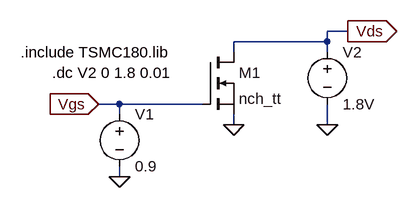
[diagram p0: schematic Problem_4c1.asc]
Problem_4c1.asc, the LTspice schematic file:
Version 4
SHEET 1 880 680
WIRE 448 64 416 64
WIRE 416 80 416 64
WIRE 416 80 272 80
WIRE 272 96 272 80
WIRE 416 96 416 80
WIRE 96 176 64 176
WIRE 224 176 96 176
WIRE 96 192 96 176
WIRE 272 208 272 192
WIRE 416 208 416 176
WIRE 96 288 96 272
FLAG 96 288 0
FLAG 272 208 0
FLAG 416 208 0
FLAG 64 176 Vgs
IOPIN 64 176 In
FLAG 448 64 Vds
IOPIN 448 64 Out
SYMBOL nmos 224 96 R0
SYMATTR InstName M1
SYMATTR Value nch_tt
SYMBOL voltage 96 176 R0
WINDOW 123 0 0 Left 0
WINDOW 39 0 0 Left 0
SYMATTR InstName V1
SYMATTR Value 0.9
SYMBOL voltage 416 80 R0
WINDOW 123 0 0 Left 0
WINDOW 39 0 0 Left 0
SYMATTR InstName V2
SYMATTR Value 1.8V
TEXT -56 96 Left 2 !.include TSMC180.lib
TEXT -8 128 Left 2 !.dc V2 0 1.8 0.01

The netlist it stands for:
* Problem_4c1.asc
M1 Vds Vgs 0 0 nch_tt
V1 Vgs 0 0.9
V2 Vds 0 1.8V
.model NMOS NMOS
.model PMOS PMOS
.lib standard.mos
.include TSMC180.lib
.dc V2 0 1.8 0.01
.backanno
.end

* Results of the author's LTspice run, read from the files saved beside the schematic
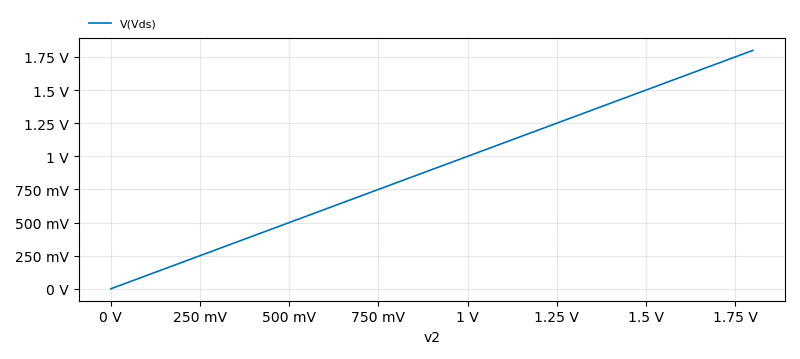
[diagram p1: DC transfer characteristic of Problem_4c1.asc, plotted from the saved traces]
* DC transfer characteristic, 1 run:
*   V(Vds): 0 V at v2=0 V, 1.8 V at v2=1.8 V, min 0 V, max 1.8 V